# EAGLE design MiniBeeProgrammer (EAGLE 5.07)
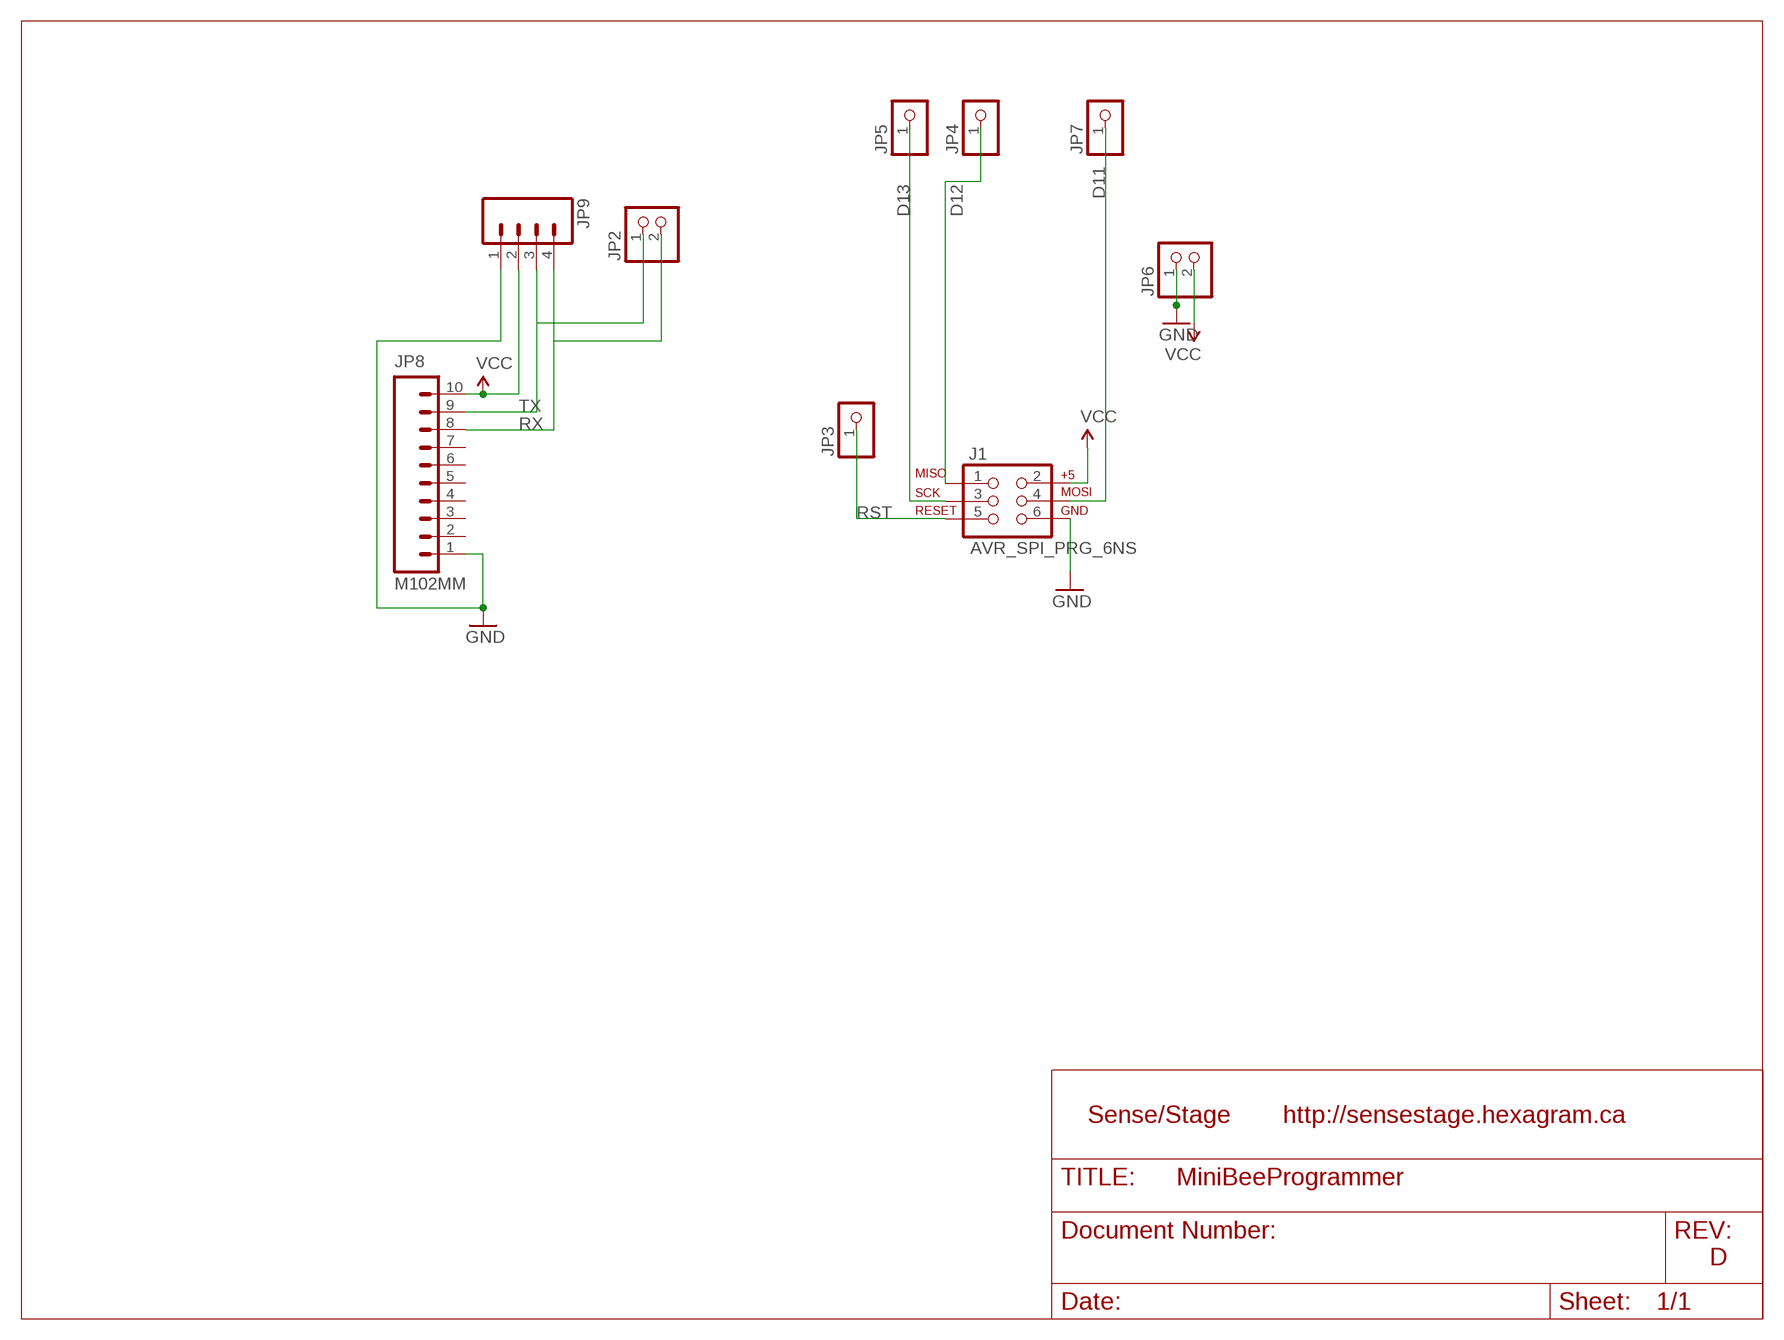
[diagram p0: schematic, sheet 1]

## Parts
J1  AVR_SPI_PRG_6NS  [2X3-NS]
JP2  PINHD-1X2  [1X02]
JP3  PINHD-1X1  [1X01]
JP4  PINHD-1X1  [1X01]
JP5  PINHD-1X1  [1X01]
JP6  PINHD-1X2  [1X02]
JP7  PINHD-1X1  [1X01]
JP8  M102MM  [1X10-2MM]
JP9  M04PTH  [1X04]

## Nets
D11: J1.4 JP7.1
D12: J1.1 JP4.1
D13: J1.3 JP5.1
GND: J1.6 JP6.1 JP8.1 JP9.1
RST: J1.5 JP3.1
RX: JP2.2 JP8.8 JP9.4
TX: JP2.1 JP8.9 JP9.3
VCC: J1.2 JP6.2 JP8.10 JP9.2
Unconnected: JP8.2 JP8.3 JP8.4 JP8.5 JP8.6 JP8.7

## Notes on the sheet
- Sense/Stage | http://sensestage.hexagram.ca
- D

## Library data of the parts
J1 = SparkFun:AVR_SPI_PRG_6: AVR ISP 6 Pin This is the reduced ISP connector for AVR programming. Common on Arduino. This footprint will take up less PCB space and can be used with a 10-pin to 6-pin adapter such as SKU: BOB-08508
JP2 JP6 = myShit:PINHD-1X2: PIN HEADER
JP3-JP5 JP7 = myShit:PINHD-1X1: PIN HEADER
JP8 = SparkFun:M10: Header 10 Standard 10-pin 0.1" header. Use with straight break away headers (SKU : PRT-00116), right angle break away headers (PRT-00553), swiss pins (PRT-00743), machine pins (PRT-00117), and female headers (PRT-00115).
JP9 = SparkFun:M04: Header 4 Standard 4-pin 0.1" header. Use with straight break away headers (SKU : PRT-00116), right angle break away headers (PRT-00553), swiss pins (PRT-00743), machine pins (PRT-00117), and female headers (PRT-00115). Molex polarized connector foot print use with SKU : PRT-08231 with associated crimp pins and housings.

## Board
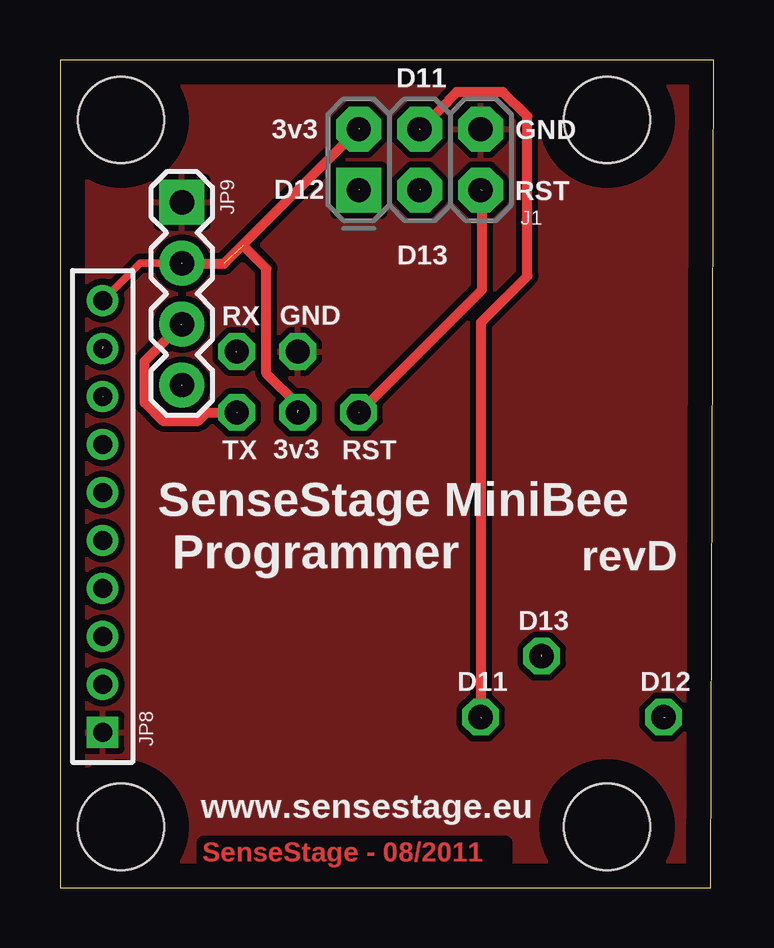
[diagram p1: board, top side]
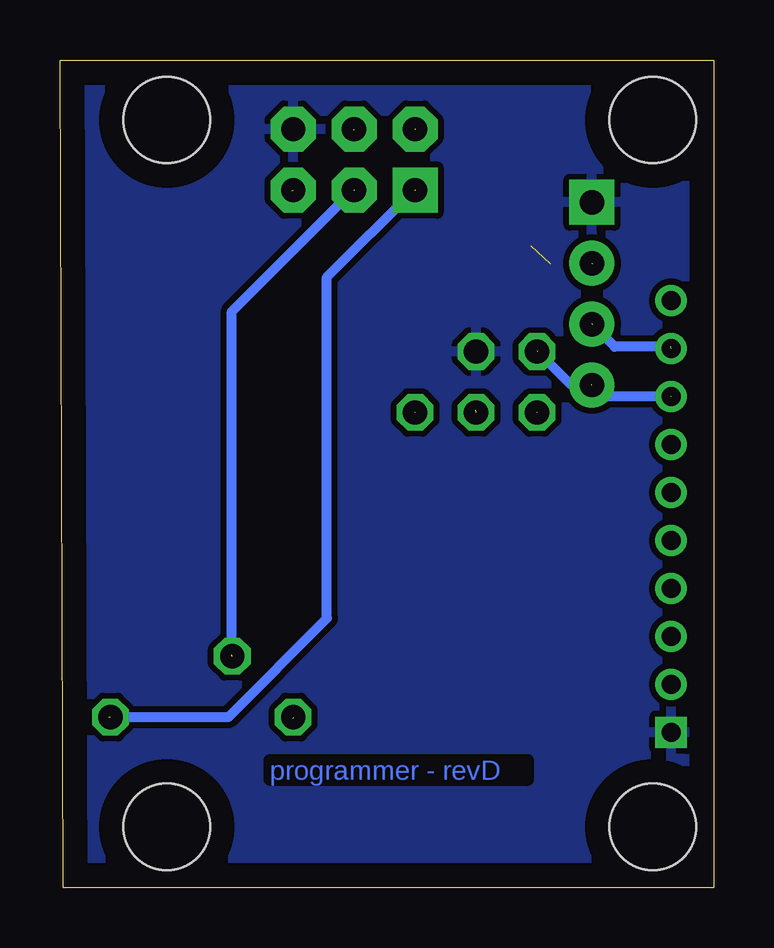
[diagram p2: board, bottom side, seen from below]

Size 27.24 x 34.51 mm. Coordinates in mm from the lower left corner, seen from the top.
Outline: 0,0 27.12,0 27.24,34.51 0,34.51 0,0
Copper layers (1*16): Top 0.035mm / dielectric 1.5mm / Bottom 0.035mm
Design rules "10mils": minimum track width 10mil, minimum drill 24mil, track to track 10mil, track to pad 10mil, pad to pad 10mil, via to via 10mil, smd to smd 10mil, copper to edge 40mil, drill to drill 10mil, minimum pad ring 10mil, minimum via ring 8mil, stop-mask expansion 0mil, vias tented up to drill 0mil, thermal gap 10mil
Holes 3.6 mm at 2.54,32 22.79,2.54 2.54,2.54 22.79,32

### Footprints (pad centres in the part's own frame; a part is rotated, then mirrored left to right if it is on the bottom)
2X3-NS@1 = drill 1.016 pad 1.88 square: 1 -2.54,-1.27 | drill 1.016 pad 1.88 octagon: 2 -2.54,1.27; 3 0,-1.27; 4 0,1.27; 5 2.54,-1.27; 6 2.54,1.27
1X02@1 = drill 1.016 octagon: 1 -1.27,0; 2 1.27,0
1X01@1 = drill 1.016 octagon: 1 0,0
1X10-2MM@1 = drill 0.8 square: 1 0,0 | drill 0.8 round: 2 2,0; 3 4,0; 4 6,0; 5 8,0; 6 10,0; 7 12,0; 8 14,0; 9 16,0; 10 18,0
1X04@1 = drill 1.016 pad 1.88 square: 1 0,0 | drill 1.016 pad 1.88 round: 2 2.54,0; 3 5.08,0; 4 7.62,0

### Placement (x,y rotation side)
J1  AVR_SPI_PRG_6NS  [2X3-NS@1]  14.99,30.35 0 top
JP2  [1X02@1]  7.37,21.08 90 top
JP3  [1X01@1]  12.45,19.81 0 top
JP4  [1X01@1]  25.15,7.11 0 top
JP5  [1X01@1]  20.07,9.65 0 top
JP6  [1X02@1]  9.91,21.08 270 top
JP7  [1X01@1]  17.53,7.11 0 top
JP8  M102MM  [1X10-2MM@1]  1.78,6.48 90 top
JP9  [1X04@1]  5.08,28.57 270 top

### Tracks (layer width: path | path; a pad name or v marks a point on that pad's centre or on a via)
D11  (2 unrouted)
  Top 0.406: 17.54,7.06 17.54,23.57 19.47,25.5 19.47,32.16 18.46,33.17 16.53,33.17 15,31.6
D12  (2 unrouted)
  Bottom 0.406: 25.21,7.11 20.23,7.11 16.12,11.23 16.12,25.45 12.46,29.11
D13  (2 unrouted)
  Bottom 0.406: 20.08,9.7 20.08,24.03 15,29.11
GND
  pour Top: 0,34.51 27.22,34.51 27.12,0 0,0.03
  pour Bottom: 0.02,0 0.02,34.6 27.22,34.6 27.02,0
RST  (2 unrouted)
  Top 0.406: 17.59,29.06 17.59,24.94 12.46,19.81
RX  (3 unrouted)
  Bottom 0.406: 5.1,20.98 4.99,20.98 | 5.1,20.98 5.96,20.98 7.33,22.35 | 1.79,20.47 4.59,20.47 5.1,20.98
TX  (4 unrouted)
  Top 0.406: 7.38,19.81 6.11,19.81 5.76,19.46 4.28,19.46 3.52,20.22 3.52,21.95 5.04,23.47
  Bottom 0.406: 1.79,22.55 4.13,22.55 5.04,23.47
VCC  (4 unrouted)
  Top 0.305: JP9.2 3.34,26.04 JP8.10
  Top 0.406: 5.04,26.01 6.82,26.01 12.46,31.65 | 9.92,19.91 9.92,20.12 8.6,21.44 8.6,25.8 7.64,26.77

### Text on the board
Top: SenseStage - 08/2011
Bottom: programmer - revD
_tsilk: D11 | 3v3 | GND | D12 | RST | D13 | RX | GND | TX | 3v3 | RST | SenseStage MiniBee | Programmer | revD | D13 | D11 | D12 | www.sensestage.eu